# Altium schematic sheet 04_MEMORY.SchDoc
size 250 x 124 mm; SheetNumber: 6; SheetTotal: 6
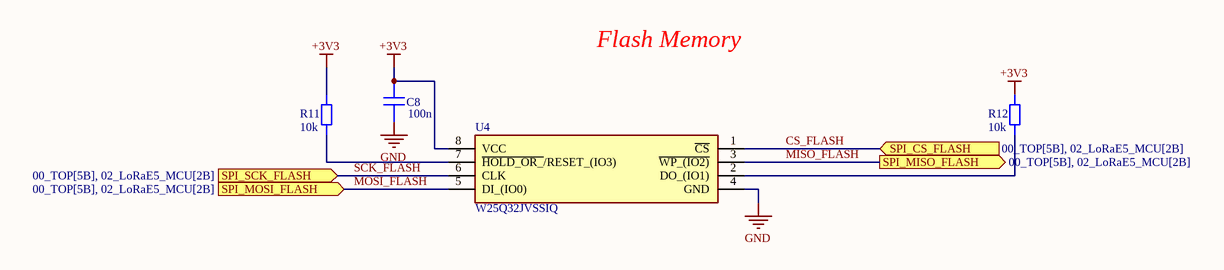
[diagram p0: 04_MEMORY.SchDoc]

## Parts
C8  100n  [Capacitor_SMD:0603_1608m]
R11  10k  [Resistor_SMD:0603_1608m]
R12  10k  [Resistor_SMD:0603_1608m]
U4  W25Q32JVSSIQ  [W25Q32JVSSIQ]

## Ports
SPI_CS_FLASH (in, see 00_TOP[5B], 02_LoRaE5_MCU[2B]), SPI_MISO_FLASH (out, see 00_TOP[5B], 02_LoRaE5_MCU[2B]), SPI_MOSI_FLASH (in, see 00_TOP[5B], 02_LoRaE5_MCU[2B]), SPI_SCK_FLASH (in, see 00_TOP[5B], 02_LoRaE5_MCU[2B])

## Nets
+3V3: C8.1 R11.1 R12.1 U4.8(VCC)
GND: C8.2 U4.4(GND)
CS_FLASH: U4.1(~{CS}) ; port SPI_CS_FLASH
MISO_FLASH: U4.3(~{WP_(IO2)}) ; port SPI_MISO_FLASH
MOSI_FLASH: U4.5(DI_(IO0)) ; port SPI_MOSI_FLASH
SCK_FLASH: U4.6(CLK) ; port SPI_SCK_FLASH
NetR11_2: R11.2 U4.7(~{HOLD_OR_}/RESET_(IO3))
NetR12_2: R12.2 U4.2(DO_(IO1))

## Notes on the sheet
- Flash Memory

## Library data of the parts
C8 = Generic_Capacitor
R11 R12 = Generic Resistor
U4 = W25Q32JVSSIQ: Manufacturer_Name: Winbond; Geometry.Height: 2.16mm; Manufacturer_Part_Number: W25Q32JVSSIQ; Mouser Part Number: 454-W25Q32JVSSIQ; Mouser Price/Stock: https://www.mouser.co.uk/ProductDetail/Winbond/W25Q32JVSSIQ?qs=qSfuJ%252Bfl%2Fd4PGZSN0WxfCA%3D%3D; Arrow Part Number: W25Q32JVSSIQ; Arrow Price/Stock: https://www.arrow.com/en/products/w25q32jvssiq/winbond-electronics?utm_currency=USD&region=nac; Datasheet Link: https://www.winbond.com/hq/search-resource-file.jsp?partNo=W25Q32JVSSIQ&type=datasheet